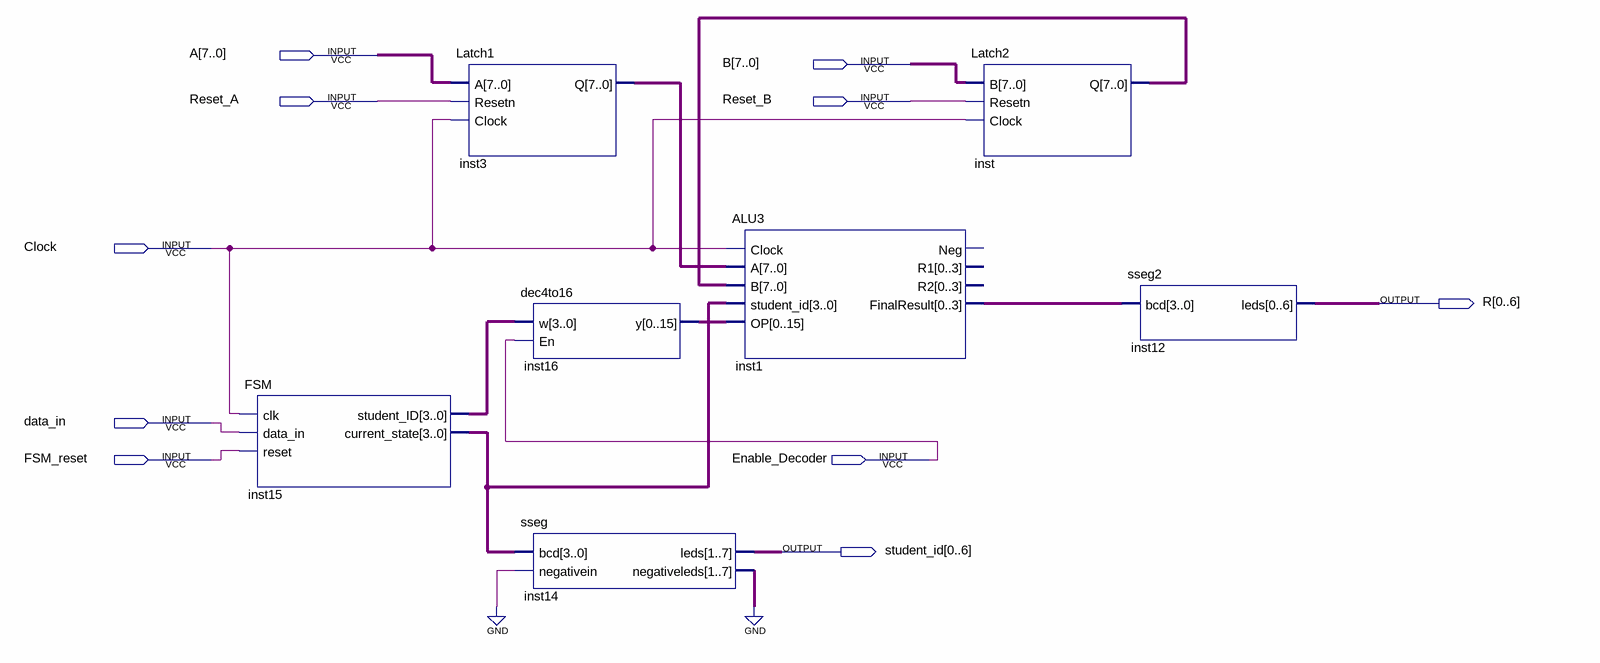
[diagram p0: schematic sheet]
// Quartus schematic Block3.bdf as structural Verilog: 7 symbols, 10 pins
module Block3 (
  input  [7:0] A,
  input  [7:0] B,
  input  Reset_A,
  input  Reset_B,
  input  Clock,
  input  data_in,
  input  FSM_reset,
  input  Enable_Decoder,
  output [0:6] R,
  output [0:6] student_id
);

  wire [3:0] inst1_finalresult, inst15_current_state, inst15_student_id;
  wire [6:0] inst14_negativeleds;
  wire [7:0] inst3_q, inst_q;
  wire [15:0] inst16_y;

  FSM inst15 (
    .clk(Clock), .data_in(data_in), .reset(FSM_reset), .student_ID(inst15_student_id),
    .current_state(inst15_current_state));
  Latch1 inst3 (.A(A), .Resetn(Reset_A), .Clock(Clock), .Q(inst3_q));
  dec4to16 inst16 (.w(inst15_student_id), .En(Enable_Decoder), .y(inst16_y));
  sseg inst14 (.bcd(inst15_current_state), .negativein(1'b0), .leds(student_id), .negativeleds(inst14_negativeleds));
  ALU3 inst1 (
    .Clock(Clock), .A(inst3_q), .B(inst_q), .student_id(inst15_current_state), .OP(inst16_y),
    .FinalResult(inst1_finalresult));  // open: Neg, R1, R2
  Latch2 inst (.B(B), .Resetn(Reset_B), .Clock(Clock), .Q(inst_q));
  sseg2 inst12 (.bcd(inst1_finalresult), .leds(R));
  // also tied to GND on the sheet: {inst14_negativeleds[0], inst14_negativeleds[1], inst14_negativeleds[2], inst14_negativeleds[3], inst14_negativeleds[4], inst14_negativeleds[5], inst14_negativeleds[6]}
endmodule
